# Altium schematic sheet PX4FMUv2.4.6_0.SchDoc: PX4FMUv2.4.6
size 282 x 200 mm; Date: 2020/2/15 15:44:23; SheetNumber: 1; GateName_1: G$1; SymbolName_1: A4L-LOC; LibraryName: pixhawk2; DeviceSetName: A4L-LOC
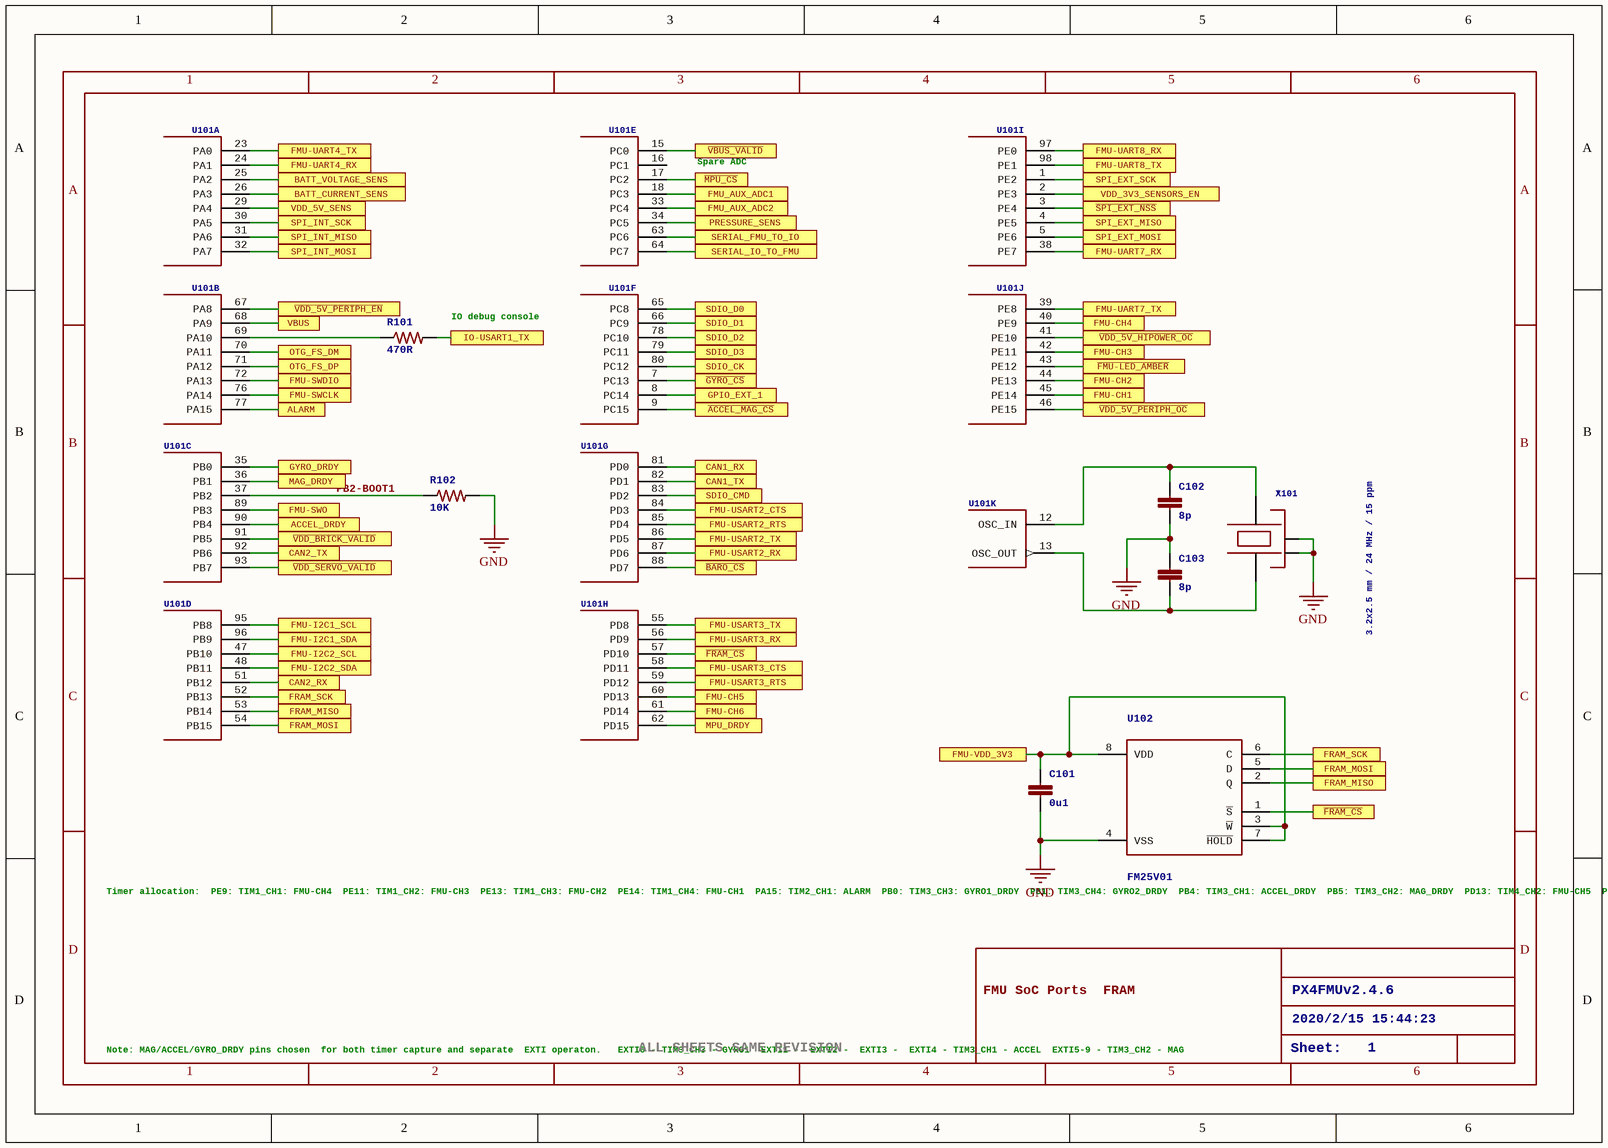
[diagram p0: PX4FMUv2.4.6_0.SchDoc]

## Parts
C101  0u1  [0402-CAP]
C102  8p  [0402-CAP]
C103  8p  [0402-CAP]
R101  470R  [0402-RES]
R102  10K  [0402-RES]
U101  STM32F4X7VX  [TQFP100]  (value not drawn)  (parts A,B,C,D,E,F,G,H,I,J,K of 14)
U102  FM25V01  [SO08]
X101  3.2x2.5 mm / 24 MHz / 15 ppm  [OSCILLATOR-3.2X2.5]

## Ports
ACCEL_DRDY, ALARM, BATT_CURRENT_SENS, BATT_VOLTAGE_SENS, CAN1_RX, CAN1_TX, CAN2_RX, CAN2_TX, FMU-CH1, FMU-CH2, FMU-CH3, FMU-CH4, FMU-CH5, FMU-CH6, FMU-I2C1_SCL, FMU-I2C1_SDA, FMU-I2C2_SCL, FMU-I2C2_SDA, FMU-SWCLK, FMU-SWDIO, FMU-SWO, FMU-UART4_RX, FMU-UART4_TX, FMU-UART7_RX, FMU-UART7_TX, FMU-UART8_RX, FMU-UART8_TX, FMU-USART2_CTS, FMU-USART2_RTS, FMU-USART2_RX, FMU-USART2_TX, FMU-USART3_CTS, FMU-USART3_RTS, FMU-USART3_RX, FMU-USART3_TX, FMU-VDD_3V3, FMU_AUX_ADC1, FMU_AUX_ADC2, FRAM_MISO, FRAM_MOSI, FRAM_SCK, GPIO_EXT_1, GYRO_DRDY, IO-USART1_TX, MAG_DRDY, MPU_DRDY, OTG_FS_DM, OTG_FS_DP, PRESSURE_SENS, SDIO_CK, SDIO_CMD, SDIO_D0, SDIO_D1, SDIO_D2, SDIO_D3, SERIAL_FMU_TO_IO, SERIAL_IO_TO_FMU, SPI_EXT_MISO, SPI_EXT_MOSI, SPI_EXT_SCK, SPI_INT_MISO, SPI_INT_MOSI, SPI_INT_SCK, VBUS, VDD_3V3_SENSORS_EN, VDD_5V_SENS, ~{ACCEL_MAG_CS}, ~{BARO_CS}, ~{FMU-LED_AMBER}, ~{FRAM_CS}, ~{GYRO_CS}, ~{MPU_CS}, ~{SPI_EXT_NSS}, ~{VBUS_VALID}, ~{VDD_5V_HIPOWER_OC}, ~{VDD_5V_PERIPH_EN}, ~{VDD_5V_PERIPH_OC}, ~{VDD_BRICK_VALID}, ~{VDD_SERVO_VALID}

## Nets
GND: C101.P$2 C102.P$2 C103.P$1 R102.P$2 U102.4(VSS) X101.2(NC_2) X101.4(NC_4)
~{ACCEL_MAG_CS}: U101.9(PC15) ; port ~{ACCEL_MAG_CS}
ACCEL_DRDY: U101.90(PB4) ; port ACCEL_DRDY
ALARM: U101.77(PA15) ; port ALARM
~{BARO_CS}: U101.88(PD7) ; port ~{BARO_CS}
BATT_CURRENT_SENS: U101.26(PA3) ; port BATT_CURRENT_SENS
BATT_VOLTAGE_SENS: U101.25(PA2) ; port BATT_VOLTAGE_SENS
CAN1_RX: U101.81(PD0) ; port CAN1_RX
CAN1_TX: U101.82(PD1) ; port CAN1_TX
CAN2_RX: U101.51(PB12) ; port CAN2_RX
CAN2_TX: U101.92(PB6) ; port CAN2_TX
~{FMU-LED_AMBER}: U101.43(PE12) ; port ~{FMU-LED_AMBER}
~{FRAM_CS}: U101.57(PD10) U102.1(~{S}) ; port ~{FRAM_CS}
FMU-CH1: U101.45(PE14) ; port FMU-CH1
FMU-CH2: U101.44(PE13) ; port FMU-CH2
FMU-CH3: U101.42(PE11) ; port FMU-CH3
FMU-CH4: U101.40(PE9) ; port FMU-CH4
FMU-CH5: U101.60(PD13) ; port FMU-CH5
FMU-CH6: U101.61(PD14) ; port FMU-CH6
FMU-I2C1_SCL: U101.95(PB8) ; port FMU-I2C1_SCL
FMU-I2C1_SDA: U101.96(PB9) ; port FMU-I2C1_SDA
FMU-I2C2_SCL: U101.47(PB10) ; port FMU-I2C2_SCL
FMU-I2C2_SDA: U101.48(PB11) ; port FMU-I2C2_SDA
FMU-SWCLK: U101.76(PA14) ; port FMU-SWCLK
FMU-SWDIO: U101.72(PA13) ; port FMU-SWDIO
FMU-SWO: U101.89(PB3) ; port FMU-SWO
FMU-UART4_RX: U101.24(PA1) ; port FMU-UART4_RX
FMU-UART4_TX: U101.23(PA0) ; port FMU-UART4_TX
FMU-UART7_RX: U101.38(PE7) ; port FMU-UART7_RX
FMU-UART7_TX: U101.39(PE8) ; port FMU-UART7_TX
FMU-UART8_RX: U101.97(PE0) ; port FMU-UART8_RX
FMU-UART8_TX: U101.98(PE1) ; port FMU-UART8_TX
FMU-USART2_CTS: U101.84(PD3) ; port FMU-USART2_CTS
FMU-USART2_RTS: U101.85(PD4) ; port FMU-USART2_RTS
FMU-USART2_RX: U101.87(PD6) ; port FMU-USART2_RX
FMU-USART2_TX: U101.86(PD5) ; port FMU-USART2_TX
FMU-USART3_CTS: U101.58(PD11) ; port FMU-USART3_CTS
FMU-USART3_RTS: U101.59(PD12) ; port FMU-USART3_RTS
FMU-USART3_RX: U101.56(PD9) ; port FMU-USART3_RX
FMU-USART3_TX: U101.55(PD8) ; port FMU-USART3_TX
FMU-VDD_3V3: C101.P$1 U102.3(~{W}) U102.7(~{HOLD}) U102.8(VDD) ; port FMU-VDD_3V3
FMU_AUX_ADC1: U101.18(PC3) ; port FMU_AUX_ADC1
FMU_AUX_ADC2: U101.33(PC4) ; port FMU_AUX_ADC2
FRAM_MISO: U101.53(PB14) U102.2(Q) ; port FRAM_MISO
FRAM_MOSI: U101.54(PB15) U102.5(D) ; port FRAM_MOSI
FRAM_SCK: U101.52(PB13) U102.6(C) ; port FRAM_SCK
~{GYRO_CS}: U101.7(PC13) ; port ~{GYRO_CS}
GPIO_EXT_1: U101.8(PC14) ; port GPIO_EXT_1
GYRO_DRDY: U101.35(PB0) ; port GYRO_DRDY
IO-USART1_TX: R101.P$2 ; port IO-USART1_TX
~{MPU_CS}: U101.17(PC2) ; port ~{MPU_CS}
MAG_DRDY: U101.36(PB1) ; port MAG_DRDY
MPU_DRDY: U101.62(PD15) ; port MPU_DRDY
OTG_FS_DM: U101.70(PA11) ; port OTG_FS_DM
OTG_FS_DP: U101.71(PA12) ; port OTG_FS_DP
PB2-BOOT1: R102.P$1 U101.37(PB2)
PRESSURE_SENS: U101.34(PC5) ; port PRESSURE_SENS
~{SPI_EXT_NSS}: U101.3(PE4) ; port ~{SPI_EXT_NSS}
SDIO_CK: U101.80(PC12) ; port SDIO_CK
SDIO_CMD: U101.83(PD2) ; port SDIO_CMD
SDIO_D0: U101.65(PC8) ; port SDIO_D0
SDIO_D1: U101.66(PC9) ; port SDIO_D1
SDIO_D2: U101.78(PC10) ; port SDIO_D2
SDIO_D3: U101.79(PC11) ; port SDIO_D3
SERIAL_FMU_TO_IO: U101.63(PC6) ; port SERIAL_FMU_TO_IO
SERIAL_IO_TO_FMU: U101.64(PC7) ; port SERIAL_IO_TO_FMU
SPI_EXT_MISO: U101.4(PE5) ; port SPI_EXT_MISO
SPI_EXT_MOSI: U101.5(PE6) ; port SPI_EXT_MOSI
SPI_EXT_SCK: U101.1(PE2) ; port SPI_EXT_SCK
SPI_INT_MISO: U101.31(PA6) ; port SPI_INT_MISO
SPI_INT_MOSI: U101.32(PA7) ; port SPI_INT_MOSI
SPI_INT_SCK: U101.30(PA5) ; port SPI_INT_SCK
~{VBUS_VALID}: U101.15(PC0) ; port ~{VBUS_VALID}
~{VDD_5V_HIPOWER_OC}: U101.41(PE10) ; port ~{VDD_5V_HIPOWER_OC}
~{VDD_5V_PERIPH_EN}: U101.67(PA8) ; port ~{VDD_5V_PERIPH_EN}
~{VDD_5V_PERIPH_OC}: U101.46(PE15) ; port ~{VDD_5V_PERIPH_OC}
~{VDD_BRICK_VALID}: U101.91(PB5) ; port ~{VDD_BRICK_VALID}
~{VDD_SERVO_VALID}: U101.93(PB7) ; port ~{VDD_SERVO_VALID}
VBUS: U101.68(PA9) ; port VBUS
VDD_3V3_SENSORS_EN: U101.2(PE3) ; port VDD_3V3_SENSORS_EN
VDD_5V_SENS: U101.29(PA4) ; port VDD_5V_SENS
NetC102_P$1: C102.P$1 U101.12(OSC_IN) X101.3
NetC103_P$2: C103.P$2 U101.13(OSC_OUT) X101.1
NetR101_P$1: R101.P$1 U101.69(PA10)

Not connected (* = marked no-connect by the designer): U101 16(PC1)

## Notes on the sheet
- Spare ADC
- (near R101) IO debug console
- (near U102) Timer allocation:
  PE9: TIM1_CH1: FMU-CH4
  PE11: TIM1_CH2: FMU-CH3
  PE13: TIM1_CH3: FMU-CH2
  PE14: TIM1_CH4: FMU-CH1
  PA15: TIM2_CH1: ALARM
  PB0: TIM3_CH3: GYRO1_DRDY
  PB1: TIM3_CH4: GYRO2_DRDY
  PB4: TIM3_CH1: ACCEL_DRDY
  PB5: TIM3_CH2: MAG_DRDY
  PD13: TIM4_CH2: FMU-CH5
  PD14: TIM4_CH3: FMU-CH6
  PD15: TIM4_CH4: spare
- FMU SoC Ports
  FRAM
- PX4FMUv2.4.6
- 2020/2/15 15:44:23
- Note: MAG/ACCEL/GYRO_DRDY pins chosen
  for both timer capture and separate
  EXTI operaton.
  EXTI0 - TIM3_CH3 - GYRO1
  EXTI1 -
  EXTI2 -
  EXTI3 -
  EXTI4 - TIM3_CH1 - ACCEL
  EXTI5-9 - TIM3_CH2 - MAG
- ALL SHEETS SAME REVISION
- Sheet:
- 1
- 2
- 3
- 4
- 5
- 6
- A
- B
- C
- D

## Library data of the parts
C101 = CAP0402: CapacitorStandard 0603 ceramic capacitor, and 0.1" leaded capacitor.; PARTNO: CC0402ZRY5V7BB104; GateName_1: G$1; SymbolName_1: CAP; DeviceName: 0402; LibraryName: pixhawk2; DeviceSetName: CAP
C102 C103 = CAP0402: CapacitorStandard 0603 ceramic capacitor, and 0.1" leaded capacitor.; PARTNO: C1005C0G1H080C; GateName_1: G$1; SymbolName_1: CAP; DeviceName: 0402; LibraryName: pixhawk2; DeviceSetName: CAP
R101 = RESISTOR0402-RES: ResistorBasic schematic elements and footprints for 0603, 1206, and PTH 1/10th watt (small) resistors.; PARTNO: RC0402FR-07470RL; GateName_1: G$1; SymbolName_1: RESISTOR; DeviceName: 0402-RES; LibraryName: pixhawk2; DeviceSetName: RESISTOR
R102 = RESISTOR0402-RES: ResistorBasic schematic elements and footprints for 0603, 1206, and PTH 1/10th watt (small) resistors.; PARTNO: RC0402FR-0710KL; GateName_1: G$1; SymbolName_1: RESISTOR; DeviceName: 0402-RES; LibraryName: pixhawk2; DeviceSetName: RESISTOR
U101 = STM32F4X7VX: STM32F4X7VX 100 pin LQFP STM32F407VE - 512 KB flash, no crypto STM32F407VG - 1 MB flash, no crypto STM32F417VE - 512 KB flash, with crypto STM32F417VG - 1 MB flash, with crypto; PARTNO: STM32F427VI; GateName_1: PORTA_L; SymbolName_1: PORT_A_L-1; GateName_2: PORTA_H; SymbolName_2: PORT_A_H-1; GateName_3: PORTB_L; SymbolName_3: PORT_B_L-1; GateName_4: PORTB_H; SymbolName_4: PORT_B_H-1; GateName_5: PORTC_L; SymbolName_5: PORT_C_L-1; GateName_6: PORTC_H; SymbolName_6: PORT_C_H-1; GateName_7: PORTD_L; SymbolName_7: PORT_D_L; GateName_8: PORTD_H; SymbolName_8: PORT_D_H; GateName_9: PORTE_L; SymbolName_9: PORT_E_L; GateName_10: PORTE_H; SymbolName_10: PORT_E_H; GateName_11: OSC; GateName_12: RESET; SymbolName_12: BOOT_RST-1; GateName_13: BAT; SymbolName_13: STM32F4X_BAT_AN_L; GateName_14: G$2; SymbolName_14: STM32F4X_VCC_VSS_L; SymbolName_11: OSC; LibraryName: pixhawk2; DeviceSetName: STM32F4X7VX
U102 = FM25V01: FM25V01 128Kb Serial 3V F-RAM Memory; PARTNO: FM25V01-G; GateName_1: G$1; SymbolName_1: FM25V01; LibraryName: pixhawk2; DeviceSetName: FM25V01; DATASHEET: http://www.ramtron.com/files/datasheets/FM25V01_ds.pdf; LINK: http://www.digikey.com/product-detail/en/FM25V01-GTR/1140-1026-1-ND/2809832; MFGPN: FM25V01
X101 = OSCILLATOR-3.2X2.5: Crystal Oscillator in 3.2x2.5 SMD; PARTNO: NX3225SA-24.000000MHZ; GateName_1: G$1; SymbolName_1: XTAL; DeviceName: -3.2X2.5; LibraryName: pixhawk2; DeviceSetName: OSCILLATOR; NAME: *